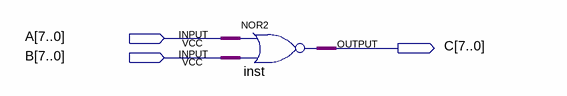
[diagram p0: schematic sheet]
// Quartus schematic NOR_.bdf as structural Verilog: 1 symbols, 3 pins
module NOR_ (
  input  [7:0] A,
  input  [7:0] B,
  output [7:0] C
);

  assign C = ~(A | B);  // NOR2 inst, 8 bits wide
endmodule
